# Altium schematic sheet passive_balancing.SchDoc
size A3; DocumentNumber: 4; SheetNumber: 4; SheetTotal: 11; SheetDescription: Passive Balancing
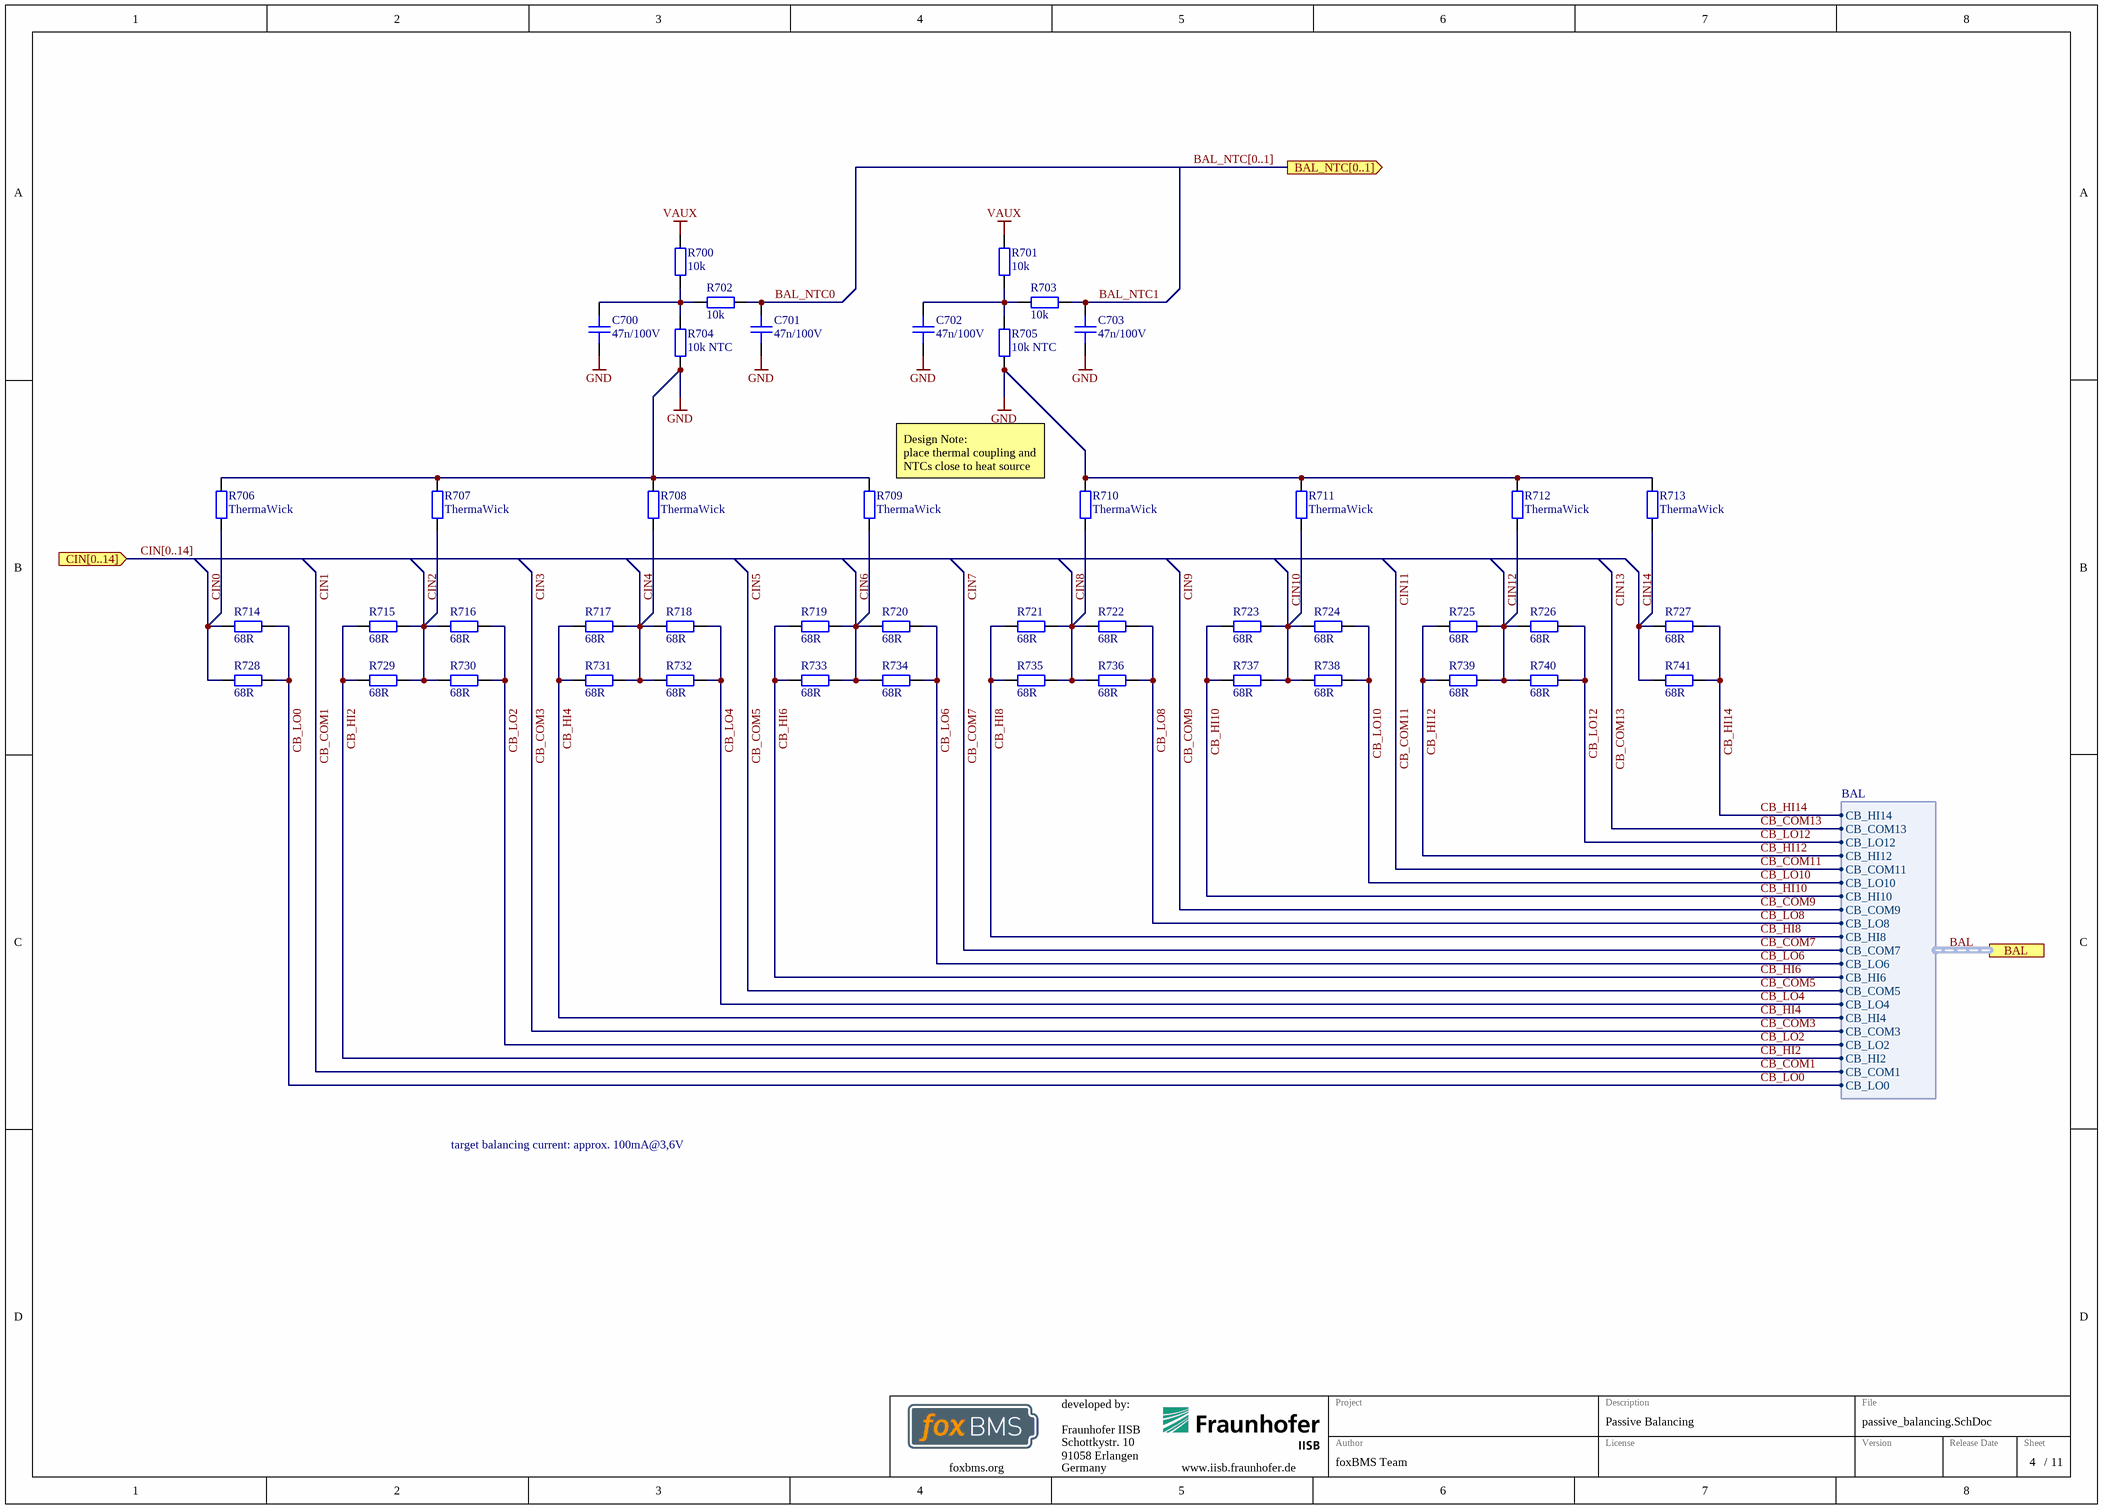
[diagram p0: passive_balancing.SchDoc]

## Parts
C700  47n/100V  [CAPC1608X08N]
C701  47n/100V  [CAPC1608X08N]
C702  47n/100V  [CAPC1608X08N]
C703  47n/100V  [CAPC1608X08N]
R700  10k  [RESC1608X05N]
R701  10k  [RESC1608X05N]
R702  10k  [RESC1608X05N]
R703  10k  [RESC1608X05N]
R704  10k NTC  [RESC1005X04N]
R705  10k NTC  [RESC1005X04N]
R706  ThermaWick  [Vishay_THJP_0603]
R707  ThermaWick  [Vishay_THJP_0603]
R708  ThermaWick  [Vishay_THJP_0603]
R709  ThermaWick  [Vishay_THJP_0603]
R710  ThermaWick  [Vishay_THJP_0603]
R711  ThermaWick  [Vishay_THJP_0603]
R712  ThermaWick  [Vishay_THJP_0603]
R713  ThermaWick  [Vishay_THJP_0603]
R714  68R  [RESC5025X07N]
R715  68R  [RESC5025X07N]
R716  68R  [RESC5025X07N]
R717  68R  [RESC5025X07N]
R718  68R  [RESC5025X07N]
R719  68R  [RESC5025X07N]
R720  68R  [RESC5025X07N]
R721  68R  [RESC5025X07N]
R722  68R  [RESC5025X07N]
R723  68R  [RESC5025X07N]
R724  68R  [RESC5025X07N]
R725  68R  [RESC5025X07N]
R726  68R  [RESC5025X07N]
R727  68R  [RESC5025X07N]
R728  68R  [RESC5025X07N]
R729  68R  [RESC5025X07N]
R730  68R  [RESC5025X07N]
R731  68R  [RESC5025X07N]
R732  68R  [RESC5025X07N]
R733  68R  [RESC5025X07N]
R734  68R  [RESC5025X07N]
R735  68R  [RESC5025X07N]
R736  68R  [RESC5025X07N]
R737  68R  [RESC5025X07N]
R738  68R  [RESC5025X07N]
R739  68R  [RESC5025X07N]
R740  68R  [RESC5025X07N]
R741  68R  [RESC5025X07N]

## Ports
BAL (harness BAL), BAL_NTC[0..1] (out), CIN[0..14] (in)

## Harnesses
BAL: CB_HI14, CB_COM13, CB_LO12, CB_HI12, CB_COM11, CB_LO10, CB_HI10, CB_COM9, CB_LO8, CB_HI8, CB_COM7, CB_LO6, CB_HI6, CB_COM5, CB_LO4, CB_HI4, CB_COM3, CB_LO2, CB_HI2, CB_COM1, CB_LO0

## Nets
GND: C700.1 C701.1 C702.1 C703.1 R704.2 R705.2 R706.2 R707.2 R708.2 R709.2 R710.2 R711.2 R712.2 R713.2
VAUX: R700.2 R701.2
BAL_NTC0: C701.2 R702.1
BAL_NTC1: C703.2 R703.1
CB_COM1: port BAL.CB_COM1  [also labelled CIN1]  [project net BAL.CB_COM1]
CB_COM3: port BAL.CB_COM3  [also labelled CIN3]  [project net BAL.CB_COM3]
CB_COM5: port BAL.CB_COM5  [also labelled CIN5]  [project net BAL.CB_COM5]
CB_COM7: port BAL.CB_COM7  [also labelled CIN7]  [project net BAL.CB_COM7]
CB_COM9: port BAL.CB_COM9  [also labelled CIN9]  [project net BAL.CB_COM9]
CB_COM11: port BAL.CB_COM11  [also labelled CIN11]  [project net BAL.CB_COM11]
CB_COM13: port BAL.CB_COM13  [also labelled CIN13]  [project net BAL.CB_COM13]
CB_HI2: R715.2 R729.2 ; port BAL.CB_HI2  [project net BAL.CB_HI2]
CB_HI4: R717.2 R731.2 ; port BAL.CB_HI4  [project net BAL.CB_HI4]
CB_HI6: R719.2 R733.2 ; port BAL.CB_HI6  [project net BAL.CB_HI6]
CB_HI8: R721.2 R735.2 ; port BAL.CB_HI8  [project net BAL.CB_HI8]
CB_HI10: R723.2 R737.2 ; port BAL.CB_HI10  [project net BAL.CB_HI10]
CB_HI12: R725.2 R739.2 ; port BAL.CB_HI12  [project net BAL.CB_HI12]
CB_HI14: R727.1 R741.1 ; port BAL.CB_HI14  [project net BAL.CB_HI14]
CB_LO0: R714.1 R728.1 ; port BAL.CB_LO0  [project net BAL.CB_LO0]
CB_LO2: R716.1 R730.1 ; port BAL.CB_LO2  [project net BAL.CB_LO2]
CB_LO4: R718.1 R732.1 ; port BAL.CB_LO4  [project net BAL.CB_LO4]
CB_LO6: R720.1 R734.1 ; port BAL.CB_LO6  [project net BAL.CB_LO6]
CB_LO8: R722.1 R736.1 ; port BAL.CB_LO8  [project net BAL.CB_LO8]
CB_LO10: R724.1 R738.1 ; port BAL.CB_LO10  [project net BAL.CB_LO10]
CB_LO12: R726.1 R740.1 ; port BAL.CB_LO12  [project net BAL.CB_LO12]
CIN0: R706.1 R714.2 R728.2
CIN2: R707.1 R715.1 R716.2 R729.1 R730.2
CIN4: R708.1 R717.1 R718.2 R731.1 R732.2
CIN6: R709.1 R719.1 R720.2 R733.1 R734.2
CIN8: R710.1 R721.1 R722.2 R735.1 R736.2
CIN10: R711.1 R723.1 R724.2 R737.1 R738.2
CIN12: R712.1 R725.1 R726.2 R739.1 R740.2
CIN14: R713.1 R727.2 R741.2
NetC700_2: C700.2 R700.1 R702.2 R704.1
NetC702_2: C702.2 R701.1 R703.2 R705.1

## Buses and harness runs
bus BAL_NTC[0..1] = port BAL_NTC[0..1]
bus CIN[0..14] = port CIN[0..14]
harness BAL = port BAL

## Notes on the sheet
- Design Note:
  place thermal coupling and NTCs close to heat source
- target balancing current: approx. 100mA@3,6V
- Fraunhofer IISB
- Schottkystr. 10
- developed by:
- 91058 Erlangen
- Germany
- Author
- Project
- License
- Description
- File
- Version
- Release Date
- Sheet
- foxbms.org <https://foxbms.org>
- www.iisb.fraunhofer.de <https://www.iisb.fraunhofer.de/>
- foxBMS Team
- /

## Library data of the parts
C700-C703 = gen_C_ceramic_47n_100V_X7R_0603: MLCC; Capacitance: 47n; Rated Voltage: 100V; Dielectric: X7R; Case EIA: 0603; Case Metric: 1608; Automotive Qualified: True; PnP Package: 0603C; Part Number: gen_C_ceramic_47n_100V_X7R_0603; Supplier 1: Farnell; Supplier Part Number 1: 2478249; Supplier 2: Farnell; Supplier Part Number 2: 2708699; Supplier 3: Farnell; Supplier Part Number 3: 2905110
R700-R703 = gen_R_10k_0603: SMD Resistor 10k 0603; Tolerance: 1%; Power: 0.1W; Case EIA: 0603; Case Metric: 1608; Maximum Working Voltage: 75V; PnP Package: 0603R; Automotive Qualified: True; Part Number: gen_R_10k_0603; Operating Temperature: -55°C - +155°C; Resistance: 10k; Series: E24, E96; PnP Value: 10k; Supplier 1: Farnell; Supplier Part Number 1: 2073349
R704 R705 = gen_R_10k_NTC_0402: SMD Resistor 10k NTC 0402; Power: 0.150W; Case EIA: 0402; Maximum Working Voltage: 50V; Automotive Qualified: True; Part Number: gen_R_10k_NTC_0402; Operating Temperature: -40°C - +150°C; Resistance: 10k NTC; Tolerance: *; Series: NTC; Supplier 1: Farnell; Supplier Part Number 1: 2432559; Supplier 2: Digikey; Supplier Part Number 2: 495-76289-1-ND
R706-R713 = Vishay_THJP_0603: ThermaWick thermal coupling 0603; Case EIA: 0603; Maximum Working Voltage: 1.5kV; Automotive Qualified: False; Part Number: Vishay_THJP_0603; Resistance: ThermaWick; Series: Thermal Jumper; Supplier 1: Mouser; Supplier Part Number 1: 71-THJP0603AST1; ECCN: EAR99
R714-R741 = gen_R_68R_2010: SMD Resistor 68R 2010; Tolerance: 1%; Power: 0.75W; Case EIA: 2010; Case Metric: 5025; Maximum Working Voltage: 200V; PnP Package: 2010R; Automotive Qualified: True; Part Number: gen_R_68R_2010; Operating Temperature: -55°C - +155°C; Resistance: 68R; Series: E24; PnP Value: 68R; Supplier 1: Farnell; Supplier Part Number 1: 2323988